# Altium project EPS.PrjPcb (part 5 of 5)
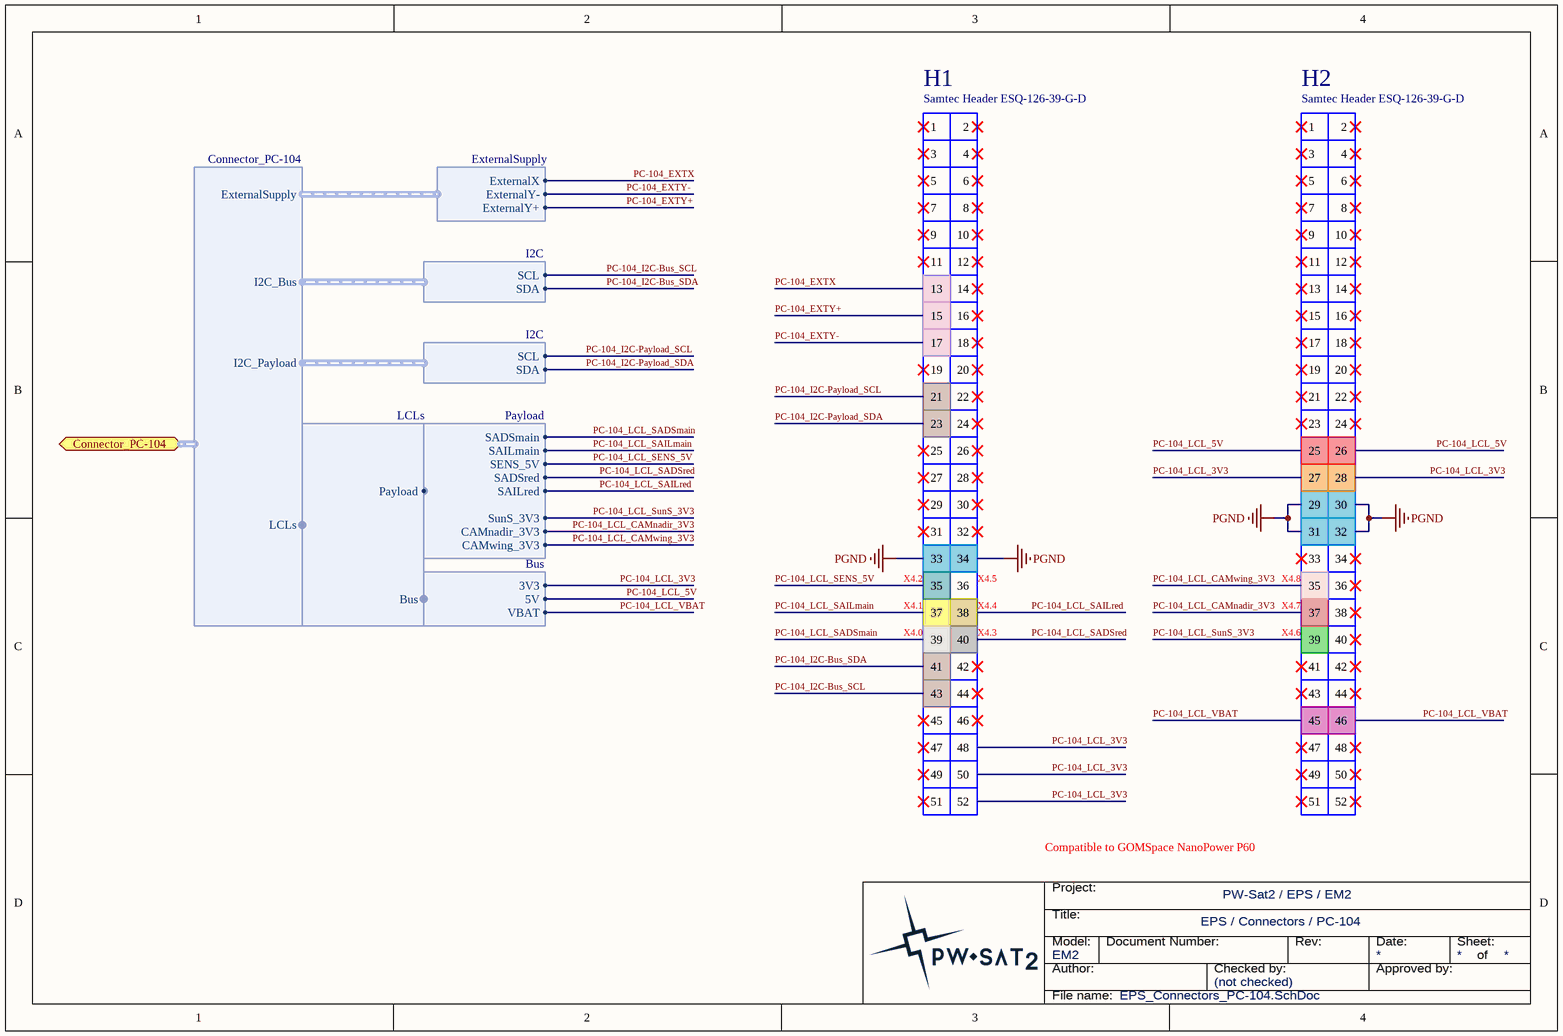
[diagram p51: EPS_Connectors_PC-104.SchDoc]

## Nets that join several sheets
AGND: Top/MPPT X/MPPTX Interface to uC (18 pins), Top/MPPT Y+/MPPTY Interface to uC (18 pins), Top/MPPT Y-/MPPTY Interface to uC (18 pins)
CTRLA_3V3a: EPS_CTRL_A (8 pins), Top/Controller A/CTRL-A_Supply (CTRL_FB1_CTRL-A_Supply.1 CTRL_FB2_CTRL-A_Supply.1), Top/MPPT X/MPPTX Measurements (MEAS_R3_MPPTX_Measurements.1), Top/MPPT Y+/MPPTY Measurements (MEAS_R3_Top_MPPT_Y+_MPPTY_Measurements.1), EPS_3V3 (TEMP_R4.2), EPS_5V (TEMP_R1.2), Top/Distribution/5V Measurements (HK_R2_5V_Measurements.1), Top/Distribution/3V3 Measurements (HK_R2_3V3_Measurements.1), Top/Distribution/VBAT Measurements (HK_R2_VBAT_Measurements.1), Top/Local-Supply and WDTs/Local-Supply CTRL-A (LS_FB1_Local-Supply_CTRL-A.2 SUPP_C1_Local-Supply_CTRL-A.1 SUPP_C2_Local-Supply_CTRL-A.1 TEMP_R5_Local-Supply_CTRL-A.2), EPS_Battery (TEMP_R2.2), Top/MPPT Y-/MPPTY Measurements (MEAS_R3_Top_MPPT_Y-_MPPTY_Measurements.1)
CTRLA_3V3d: EPS_CTRL_A (20 pins), Top/Controller A/I2C Repeater (7 pins), Top/Controller A/CTRL-A_Supply (CTRL_C1_CTRL-A_Supply.1 CTRL_C2_CTRL-A_Supply.1 CTRL_C8_CTRL-A_Supply.1 CTRL_C9_CTRL-A_Supply.1), EPS_DCDC_RLCLs (SEL_C2.1 SEL_R10.2 SEL_U1.5), Top/LCLs for DCDC/DCDC RLCL (RLCL_R3_DCDC_RLCL.2), Top/LCLs for DCDC/VBAT RLCL (RLCL_R3_VBAT_RLCL.2), EPS_Local-Supply (LS_D1.A LS_R9.2), Top/Local-Supply and WDTs/Local-Supply CTRL-A (SUPP_C5_Local-Supply_CTRL-A.1 SUPP_C6_Local-Supply_CTRL-A.1 SUPP_R2_Local-Supply_CTRL-A.1 SUPP_U3_Local-Supply_CTRL-A.6), EPS_Battery_Controller_Current-Meas (BATC_R3.1 BATC_R4.1), EPS_Battery_Heaters-Control (HTR_R1.2), EPS_CTRL_B (CTRLB_R3.2)
CTRLAB_3V3d: Top/Distribution/LCL-FPF SunS 3V3 (LCL_R2_LCL-FPF_SunS_3V3.1), Top/Distribution/LCL-FPF CAMnadir 3V3 (LCL_R2_LCL-FPF_CAMnadir_3V3.1), Top/Distribution/LCL-FPF CAMwing 3V3 (LCL_R2_LCL-FPF_CAMwing_3V3.1), Top/Distribution/LCL-TK MAIN (LCLTK_R6_LCL-TK_MAIN.1), Top/Distribution/LCL-TK Redundant (LCLTK_R6_LCL-TK_Redundant.1), Top/Distribution/LCL-FPF SENS 5V (LCL_R2_LCL-FPF_SENS_5V.1), Top/Distribution/LCL-FPF ANTs 5V (LCL_R2_Top_Distribution_LCL-FPF_ANTs_5V#1.1), Top/Distribution/LCL-FPF ANTs 5V (LCL_R2_Top_Distribution_LCL-FPF_ANTs_5V#2.1), EPS_DCDC_RLCLs (SEL_R1.2), EPS_Local-Supply (LS_R7.2 LS_R8.1 LS_R10.2), EPS_Battery_Controller_RLCL (RLCLB_R1.2)
CTRLB_3V3a: Top/Local-Supply and WDTs/Local-Supply CTRL-B (LS_FB1_Local-Supply_CTRL-B.2 SUPP_C1_Local-Supply_CTRL-B.1 SUPP_C2_Local-Supply_CTRL-B.1 TEMP_R5_Local-Supply_CTRL-B.2), EPS_CTRL_B (CTRLB_R10.2), Top/Controller B/CTRL-B_Supply (CTRL_FB1_CTRL-B_Supply.1 CTRL_FB2_CTRL-B_Supply.1)
CTRLB_3V3d: EPS_CTRL_A (CTRLA_R14.2), EPS_DCDC_RLCLs (SEL_C3.1 SEL_R11.2 SEL_U2.5), EPS_Local-Supply (LS_D2.A LS_R11.2), Top/Local-Supply and WDTs/Local-Supply CTRL-B (SUPP_C5_Local-Supply_CTRL-B.1 SUPP_C6_Local-Supply_CTRL-B.1 SUPP_R2_Local-Supply_CTRL-B.1 SUPP_U3_Local-Supply_CTRL-B.6), EPS_CTRL_B (13 pins), Top/Controller B/I2C Repeater (7 pins), Top/Controller B/CTRL-B_Supply (CTRL_C1_CTRL-B_Supply.1 CTRL_C2_CTRL-B_Supply.1 CTRL_C8_CTRL-B_Supply.1 CTRL_C9_CTRL-B_Supply.1)
CTRLB_Vref: EPS_CTRL_B (CTRLB_R9.2 CTRLB_U1.29), Top/Controller B/CTRL-B_Supply (CTRL_C5_CTRL-B_Supply.1 CTRL_C6_CTRL-B_Supply.1 CTRL_R1_CTRL-B_Supply.1 CTRL_REF1_CTRL-B_Supply.1)
DGND: EPS_CTRL_A (21 pins), Top/Controller A/I2C Repeater (5 pins), Top/Controller A/CTRL-A_Supply (12 pins), Top/Controller A/Temperature-Sensor (TEMP_C1_Top_Controller_A_Temperature-Sensor.2 TEMP_U1_Top_Controller_A_Temperature-Sensor.2), Top/Distribution/5V Measurements (HK_C4_5V_Measurements.2), Top/Distribution/3V3 Measurements (HK_C4_3V3_Measurements.2), Top/Distribution/VBAT Measurements (HK_C4_VBAT_Measurements.2), EPS_Local-Supply (LS_R9.1 LS_R10.1 LS_R11.1), EPS_CTRL_B (14 pins), Top/Controller B/I2C Repeater (5 pins), Top/Controller B/Temperature-Sensor (TEMP_C1_Top_Controller_B_Temperature-Sensor.2 TEMP_U1_Top_Controller_B_Temperature-Sensor.2), Top/Controller B/CTRL-B_Supply (12 pins)
PGND: EPS_Connectors (13 pins), Top/Controller A/CTRL-A_Supply (CTRL_J1_CTRL-A_Supply.1), EPS_MPPT_X_Boost-Converter (13 pins), EPS_MPPT_X_OR_Solar (8 pins), EPS_MPPT_X_EMI-Filter_Solar-Panels (5 pins), Top/MPPT X/MPPTX Interface to uC (MPPT_C10_MPPTX_Interface_to_uC.2 MPPT_J1_MPPTX_Interface_to_uC.1 MPPT_U4_MPPTX_Interface_to_uC.2), Top/MPPT X/MPPTX Measurements (5 pins), EPS_MPPT_X_EMI-Filter_In (EMIXI_C1.2 EMIXI_C2.2), EPS_MPPT_X_EMI-Filter_Out (EMIXO_C1.2 EMIXO_C2.2 EMIXO_C3.2), EPS_MPPT_X_OR_MPB (SUMPBX_C4.2 SUMPBX_R4.2 SUMPBX_R6.2), Top/MPPT Y+/MPPTY Buck-Boost Converter (20 pins), Top/MPPT Y+/MPPTY Solar Panels ORing (8 pins), Top/MPPT Y+/MPPTY EMI Filters for Solar Panels (EMIYS_C1_Top_MPPT_Y+_MPPTY_EMI_Filters_for_Solar_Panels.2 EMIYS_C2_Top_MPPT_Y+_MPPTY_EMI_Filters_for_Solar_Panels.2 EMIYS_T1_Top_MPPT_Y+_MPPTY_EMI_Filters_for_Solar_Panels.3), Top/MPPT Y+/MPPTY Interface to uC (MPPT_C10_Top_MPPT_Y+_MPPTY_Interface_to_uC.2 MPPT_J1_Top_MPPT_Y+_MPPTY_Interface_to_uC.1 MPPT_U4_Top_MPPT_Y+_MPPTY_Interface_to_uC.2), Top/MPPT Y+/MPPTY Measurements (5 pins), Top/MPPT Y+/MPPTY Input EMI Filter (EMIYI_C1_Top_MPPT_Y+_MPPTY_Input_EMI_Filter.2 EMIYI_C2_Top_MPPT_Y+_MPPTY_Input_EMI_Filter.2), Top/MPPT Y+/MPPTY Output EMI Filter (EMIYO_C1_Top_MPPT_Y+_MPPTY_Output_EMI_Filter.2 EMIYO_C2_Top_MPPT_Y+_MPPTY_Output_EMI_Filter.2 EMIYO_C3_Top_MPPT_Y+_MPPTY_Output_EMI_Filter.2), Top/MPPT Y+/MPPTY ORing to MPB (5 pins), EPS_3V3_Buck-Converter (17 pins), EPS_3V3_EMI-Filter_In (EMIAA_C2.2 EMIAA_C3.2), EPS_3V3_EMI-Filter_Out (EMIAB_C2.2 EMIAB_C3.2 EMIAB_C4.2), Top/3V3/Temperature-Sensor (TEMP_C1_Top_3V3_Temperature-Sensor.2 TEMP_U1_Top_3V3_Temperature-Sensor.2), EPS_5V_Buck-Converter (17 pins), EPS_5V_EMI-Filter_In (EMIBA_C2.2 EMIBA_C3.2), EPS_5V_EMI-Filter_Out (EMIBB_C2.2 EMIBB_C3.2 EMIBB_C4.2), Top/5V/Temperature-Sensor (TEMP_C1_Top_5V_Temperature-Sensor.2 TEMP_U1_Top_5V_Temperature-Sensor.2), EPS_RBL (RBL_C2.2 RBL_C4.2 RBL_Q2.E RBL_Q4.E), EPS_Distribution (8 pins), Top/Distribution/LCL-FPF SunS 3V3 (LCL_C2_LCL-FPF_SunS_3V3.2 LCL_C3_LCL-FPF_SunS_3V3.2 LCL_R3_LCL-FPF_SunS_3V3.1 LCL_R5_LCL-FPF_SunS_3V3.1), Top/Distribution/LCL-FPF CAMnadir 3V3 (LCL_C2_LCL-FPF_CAMnadir_3V3.2 LCL_C3_LCL-FPF_CAMnadir_3V3.2 LCL_R3_LCL-FPF_CAMnadir_3V3.1 LCL_R5_LCL-FPF_CAMnadir_3V3.1), Top/Distribution/LCL-FPF CAMwing 3V3 (LCL_C2_LCL-FPF_CAMwing_3V3.2 LCL_C3_LCL-FPF_CAMwing_3V3.2 LCL_R3_LCL-FPF_CAMwing_3V3.1 LCL_R5_LCL-FPF_CAMwing_3V3.1), Top/Distribution/LCL-TK MAIN (10 pins), Top/Distribution/LCL-TK Redundant (10 pins), Top/Distribution/LCL-FPF SENS 5V (LCL_C2_LCL-FPF_SENS_5V.2 LCL_C3_LCL-FPF_SENS_5V.2 LCL_R3_LCL-FPF_SENS_5V.1 LCL_R5_LCL-FPF_SENS_5V.1), Top/Distribution/RLCL-FPF 5V (6 pins), Top/Distribution/5V Measurements (5 pins), Top/Distribution/3V3 Measurements (5 pins), Top/Distribution/VBAT Measurements (5 pins), Top/Distribution/LCL-FPF ANTs 5V (LCL_C2_Top_Distribution_LCL-FPF_ANTs_5V#1.2 LCL_C3_Top_Distribution_LCL-FPF_ANTs_5V#1.2 LCL_R3_Top_Distribution_LCL-FPF_ANTs_5V#1.1 LCL_R5_Top_Distribution_LCL-FPF_ANTs_5V#1.1), Top/Distribution/RLCL-FPF 3V3 (6 pins), Top/Distribution/LCL-FPF ANTs 5V (LCL_C2_Top_Distribution_LCL-FPF_ANTs_5V#2.2 LCL_C3_Top_Distribution_LCL-FPF_ANTs_5V#2.2 LCL_R3_Top_Distribution_LCL-FPF_ANTs_5V#2.1 LCL_R5_Top_Distribution_LCL-FPF_ANTs_5V#2.1), EPS_VBAT_EMI-Filter (EMIVBAT_C3.2 EMIVBAT_C4.2 EMIVBAT_C5.2), EPS_DCDC_RLCLs (13 pins), Top/LCLs for DCDC/DCDC RLCL (RLCL_C4_DCDC_RLCL.2 RLCL_C5_DCDC_RLCL.2 RLCL_R4_DCDC_RLCL.1 RLCL_R5_DCDC_RLCL.2), Top/LCLs for DCDC/VBAT RLCL (RLCL_C4_VBAT_RLCL.2 RLCL_C5_VBAT_RLCL.2 RLCL_R4_VBAT_RLCL.1 RLCL_R5_VBAT_RLCL.2), EPS_Local-Supply (LS_C2.2 LS_R4.2), Top/Local-Supply and WDTs/Local-Supply CTRL-A (17 pins), Top/Local-Supply and WDTs/Local-Supply CTRL-A/Temperature-Sensor (TEMP_C1_Top_Local-Supply_and_WDTs_Local-Supply_CTRL-A_Temperature-Sensor.2 TEMP_U1_Top_Local-Supply_and_WDTs_Local-Supply_CTRL-A_Temperature-Sensor.2), Top/Local-Supply and WDTs/Local-Supply CTRL-B (17 pins), Top/Local-Supply and WDTs/Local-Supply CTRL-B/Temperature-Sensor (TEMP_C1_Top_Local-Supply_and_WDTs_Local-Supply_CTRL-B_Temperature-Sensor.2 TEMP_U1_Top_Local-Supply_and_WDTs_Local-Supply_CTRL-B_Temperature-Sensor.2), EPS_Battery_Controller_Current-Meas (BATC_R2.2 BATC_R5.1), EPS_Battery_Controller_Voltage-Meas (BATV_C1.2 BATV_C2.2 BATV_R2.2 BATV_R4.2), EPS_Battery_Controller_Diode (BATD_R2.2), EPS_Battery_Controller_RLCL (9 pins), EPS_Battery_Heaters-Control (HTR_Q2.E HTR_Q3.S HTR_R3.1 HTR_R7.1), Top/Battery Pack/Temperature-Sensor (TEMP_C1_Top_Battery_Pack_Temperature-Sensor.2 TEMP_U1_Top_Battery_Pack_Temperature-Sensor.2), Top/MPPT Y-/MPPTY Buck-Boost Converter (20 pins), Top/MPPT Y-/MPPTY Solar Panels ORing (8 pins), Top/MPPT Y-/MPPTY EMI Filters for Solar Panels (EMIYS_C1_Top_MPPT_Y-_MPPTY_EMI_Filters_for_Solar_Panels.2 EMIYS_C2_Top_MPPT_Y-_MPPTY_EMI_Filters_for_Solar_Panels.2 EMIYS_T1_Top_MPPT_Y-_MPPTY_EMI_Filters_for_Solar_Panels.3), Top/MPPT Y-/MPPTY Interface to uC (MPPT_C10_Top_MPPT_Y-_MPPTY_Interface_to_uC.2 MPPT_J1_Top_MPPT_Y-_MPPTY_Interface_to_uC.1 MPPT_U4_Top_MPPT_Y-_MPPTY_Interface_to_uC.2), Top/MPPT Y-/MPPTY Measurements (5 pins), Top/MPPT Y-/MPPTY Input EMI Filter (EMIYI_C1_Top_MPPT_Y-_MPPTY_Input_EMI_Filter.2 EMIYI_C2_Top_MPPT_Y-_MPPTY_Input_EMI_Filter.2), Top/MPPT Y-/MPPTY Output EMI Filter (EMIYO_C1_Top_MPPT_Y-_MPPTY_Output_EMI_Filter.2 EMIYO_C2_Top_MPPT_Y-_MPPTY_Output_EMI_Filter.2 EMIYO_C3_Top_MPPT_Y-_MPPTY_Output_EMI_Filter.2), Top/MPPT Y-/MPPTY ORing to MPB (5 pins), EPS_CTRL_B (CTRLB_C5.2 CTRLB_J1.1), Top/Controller B/CTRL-B_Supply (CTRL_J1_CTRL-B_Supply.1), EPS_Connectors_PC-104 (6 pins)
BAT_MEAS_VOLTAGE_N: EPS_CTRL_A (CTRLA_U3.10), EPS_Battery_Controller_Voltage-Meas (BATV_C1.1 BATV_R1.2 BATV_R2.1)
BAT_MEAS_VOLTAGE_R: EPS_Battery_Controller_Voltage-Meas (BATV_C2.1 BATV_R3.2 BATV_R4.1), EPS_CTRL_B (CTRLB_U1.36)
CHRG_LCL_FB: EPS_CTRL_A (CTRLA_R20.2 CTRLA_U4.43), EPS_Battery_Controller_RLCL (RLCLB_U1.7)
CHRG_LCLN_ON: EPS_CTRL_A (CTRLA_U4.33), EPS_Battery_Controller_RLCL (RLCLB_R10.1)
CHRG_LCLR_ON: EPS_Battery_Controller_RLCL (RLCLB_R9.1), EPS_CTRL_B (CTRLB_U1.11)
CHRG_MEAS_CURRENT: EPS_CTRL_A (CTRLA_U3.12), EPS_Battery_Controller_Current-Meas (BATC_U1.2)
CTRLA_BATC_CURR_DCHRG: EPS_CTRL_A (CTRLA_U3.11), EPS_Battery_Controller_Current-Meas (BATC_U2.2)
CTRLA_BATC_Heater: EPS_CTRL_A (CTRLA_U4.34), EPS_Battery_Heaters-Control (HTR_R8.2)
CTRLA_BATC_TEMP: EPS_CTRL_A (CTRLA_U3.13), Top/Battery Pack/Temperature-Sensor (TEMP_R1_Top_Battery_Pack_Temperature-Sensor.2)
CTRLA_BURN_SADS: EPS_CTRL_A (CTRLA_U4.42), Top/Distribution/LCL-TK MAIN (LCLTK_R11_LCL-TK_MAIN.2 LCLTK_R12_LCL-TK_MAIN.2)
CTRLA_BURN_SAIL: EPS_CTRL_A (CTRLA_U4.41), Top/Distribution/LCL-TK MAIN (LCLTK_R3_LCL-TK_MAIN.2 LCLTK_R5_LCL-TK_MAIN.2)
CTRLA_HK_3V3_CURR: EPS_CTRL_A (CTRLA_U2.6), Top/Distribution/3V3 Measurements (HK_C4_3V3_Measurements.1 HK_R5_3V3_Measurements.2)
CTRLA_HK_3V3_TEMP: EPS_CTRL_A (CTRLA_U2.11), Top/3V3/Temperature-Sensor (TEMP_R1_Top_3V3_Temperature-Sensor.2)
CTRLA_HK_3V3_VOLT: EPS_CTRL_A (CTRLA_U2.7), Top/Distribution/3V3 Measurements (HK_C1_3V3_Measurements.1 HK_R3_3V3_Measurements.2 HK_R4_3V3_Measurements.1)
CTRLA_HK_5V_CURR: EPS_CTRL_A (CTRLA_U2.13), Top/Distribution/5V Measurements (HK_C4_5V_Measurements.1 HK_R5_5V_Measurements.2)
CTRLA_HK_5V_TEMP: EPS_CTRL_A (CTRLA_U2.10), Top/5V/Temperature-Sensor (TEMP_R1_Top_5V_Temperature-Sensor.2)
CTRLA_HK_5V_VOLT: EPS_CTRL_A (CTRLA_U2.12), Top/Distribution/5V Measurements (HK_C1_5V_Measurements.1 HK_R3_5V_Measurements.2 HK_R4_5V_Measurements.1)
CTRLA_HK_SUPP_TEMP: EPS_CTRL_A (CTRLA_U3.7), Top/Local-Supply and WDTs/Local-Supply CTRL-A/Temperature-Sensor (TEMP_R1_Top_Local-Supply_and_WDTs_Local-Supply_CTRL-A_Temperature-Sensor.2)
CTRLA_HK_TEMP: EPS_CTRL_A (CTRLA_U3.5), Top/Controller A/Temperature-Sensor (TEMP_R1_Top_Controller_A_Temperature-Sensor.2)
CTRLA_HK_VBAT_CURR: EPS_CTRL_A (CTRLA_U2.4), Top/Distribution/VBAT Measurements (HK_C4_VBAT_Measurements.1 HK_R5_VBAT_Measurements.2)
CTRLA_HK_VBAT_VOLT: EPS_CTRL_A (CTRLA_U2.5), Top/Distribution/VBAT Measurements (HK_C1_VBAT_Measurements.1 HK_R3_VBAT_Measurements.2 HK_R4_VBAT_Measurements.1)
CTRLA_LCLs_ANTs_FlagB: EPS_CTRL_A (CTRLA_R12.2 CTRLA_U4.46), Top/Distribution/LCL-FPF ANTs 5V (LCL_U1_Top_Distribution_LCL-FPF_ANTs_5V#1.7)
CTRLA_LCLs_ANTs_ON: EPS_CTRL_A (CTRLA_U4.40), Top/Distribution/LCL-FPF ANTs 5V (LCL_R4_Top_Distribution_LCL-FPF_ANTs_5V#1.2)
CTRLA_LCLs_CAMnadir_FlagB: EPS_CTRL_A (CTRLA_R8.2 CTRLA_U4.49), Top/Distribution/LCL-FPF CAMnadir 3V3 (LCL_U1_LCL-FPF_CAMnadir_3V3.7)
CTRLA_LCLs_CAMnadir_ON: EPS_CTRL_A (CTRLA_U4.37), Top/Distribution/LCL-FPF CAMnadir 3V3 (LCL_R4_LCL-FPF_CAMnadir_3V3.2)
CTRLA_LCLs_CAMwing_FlagB: EPS_CTRL_A (CTRLA_R9.2 CTRLA_U4.48), Top/Distribution/LCL-FPF CAMwing 3V3 (LCL_U1_LCL-FPF_CAMwing_3V3.7)
CTRLA_LCLs_CAMwing_ON: EPS_CTRL_A (CTRLA_U4.38), Top/Distribution/LCL-FPF CAMwing 3V3 (LCL_R4_LCL-FPF_CAMwing_3V3.2)
CTRLA_LCLs_SENS_FlagB: EPS_CTRL_A (CTRLA_R10.2 CTRLA_U4.47), Top/Distribution/LCL-FPF SENS 5V (LCL_U1_LCL-FPF_SENS_5V.7)
CTRLA_LCLs_SENS_ON: EPS_CTRL_A (CTRLA_U4.39), Top/Distribution/LCL-FPF SENS 5V (LCL_R4_LCL-FPF_SENS_5V.2)
CTRLA_LCLs_Suns_FlagB: EPS_CTRL_A (CTRLA_R5.2 CTRLA_U4.50), Top/Distribution/LCL-FPF SunS 3V3 (LCL_U1_LCL-FPF_SunS_3V3.7)
CTRLA_LCLs_SunS_ON: EPS_CTRL_A (CTRLA_U4.36), Top/Distribution/LCL-FPF SunS 3V3 (LCL_R4_LCL-FPF_SunS_3V3.2)
CTRLA_LCLs_TKmain_FlagB: EPS_CTRL_A (CTRLA_R2.2 CTRLA_U4.51), Top/Distribution/LCL-TK MAIN (LCLTK_U1_LCL-TK_MAIN.7)
CTRLA_LCLs_TKmain_ON: EPS_CTRL_A (CTRLA_U4.35), Top/Distribution/LCL-TK MAIN (LCLTK_R13_LCL-TK_MAIN.2)
CTRLB_BATC_Heater: EPS_Battery_Heaters-Control (HTR_R6.1), EPS_CTRL_B (CTRLB_U1.12)
CTRLB_BURN_SADS: Top/Distribution/LCL-TK Redundant (LCLTK_R11_LCL-TK_Redundant.2 LCLTK_R12_LCL-TK_Redundant.2), EPS_CTRL_B (CTRLB_U1.16)
CTRLB_BURN_SAIL: Top/Distribution/LCL-TK Redundant (LCLTK_R3_LCL-TK_Redundant.2 LCLTK_R5_LCL-TK_Redundant.2), EPS_CTRL_B (CTRLB_U1.15)
CTRLB_HK_SUPP_TEMP: Top/Local-Supply and WDTs/Local-Supply CTRL-B/Temperature-Sensor (TEMP_R1_Top_Local-Supply_and_WDTs_Local-Supply_CTRL-B_Temperature-Sensor.2), EPS_CTRL_B (CTRLB_U1.34)
CTRLB_HK_TEMP: EPS_CTRL_B (CTRLB_U1.37), Top/Controller B/Temperature-Sensor (TEMP_R1_Top_Controller_B_Temperature-Sensor.2)
CTRLB_LCLs_ANTs_FlagB: Top/Distribution/LCL-FPF ANTs 5V (LCL_U1_Top_Distribution_LCL-FPF_ANTs_5V#2.7), EPS_CTRL_B (CTRLB_R2.2 CTRLB_U1.30)
CTRLB_LCLs_ANTs_ON: Top/Distribution/LCL-FPF ANTs 5V (LCL_R4_Top_Distribution_LCL-FPF_ANTs_5V#2.2), EPS_CTRL_B (CTRLB_U1.26)
CTRLB_LCLs_TKred_FlagB: Top/Distribution/LCL-TK Redundant (LCLTK_U1_LCL-TK_Redundant.7), EPS_CTRL_B (CTRLB_R1.2 CTRLB_U1.31)
CTRLB_LCLs_TKred_ON: Top/Distribution/LCL-TK Redundant (LCLTK_R13_LCL-TK_Redundant.2), EPS_CTRL_B (CTRLB_U1.25)
MPPT_3V3a: EPS_CTRL_A (CTRLA_J1.1), Top/MPPT X/MPPTX Interface to uC (12 pins)
MPPT_3V3a: EPS_CTRL_A (CTRLA_J2.1), Top/MPPT Y+/MPPTY Interface to uC (12 pins)
MPPT_3V3a: EPS_CTRL_A (CTRLA_J4.1), Top/MPPT Y-/MPPTY Interface to uC (12 pins)
MPPT_CS_ADC: EPS_CTRL_A (CTRLA_R1.1), Top/MPPT X/MPPTX Interface to uC (MPPT_U3_MPPTX_Interface_to_uC.1)
MPPT_CS_ADC: EPS_CTRL_A (CTRLA_R11.2), Top/MPPT Y+/MPPTY Interface to uC (MPPT_U3_Top_MPPT_Y+_MPPTY_Interface_to_uC.1)
MPPT_CS_ADC: EPS_CTRL_A (CTRLA_R24.2), Top/MPPT Y-/MPPTY Interface to uC (MPPT_U3_Top_MPPT_Y-_MPPTY_Interface_to_uC.1)
MPPT_CS_DAC: EPS_CTRL_A (CTRLA_R1.2), Top/MPPT X/MPPTX Interface to uC (MPPT_U2_MPPTX_Interface_to_uC.6)
MPPT_CS_DAC: EPS_CTRL_A (CTRLA_R11.4), Top/MPPT Y+/MPPTY Interface to uC (MPPT_U2_Top_MPPT_Y+_MPPTY_Interface_to_uC.6)
MPPT_CS_DAC: EPS_CTRL_A (CTRLA_R24.1), Top/MPPT Y-/MPPTY Interface to uC (MPPT_U2_Top_MPPT_Y-_MPPTY_Interface_to_uC.6)
MPPT_DIN: EPS_CTRL_A (CTRLA_R1.3), Top/MPPT X/MPPTX Interface to uC (MPPT_U2_MPPTX_Interface_to_uC.4 MPPT_U3_MPPTX_Interface_to_uC.8)
MPPT_DIN: EPS_CTRL_A (CTRLA_R11.3), Top/MPPT Y+/MPPTY Interface to uC (MPPT_U2_Top_MPPT_Y+_MPPTY_Interface_to_uC.4 MPPT_U3_Top_MPPT_Y+_MPPTY_Interface_to_uC.8)
MPPT_DIN: EPS_CTRL_A (CTRLA_R24.4), Top/MPPT Y-/MPPTY Interface to uC (MPPT_U2_Top_MPPT_Y-_MPPTY_Interface_to_uC.4 MPPT_U3_Top_MPPT_Y-_MPPTY_Interface_to_uC.8)
MPPT_DOUT: EPS_CTRL_A (CTRLA_R1.4), Top/MPPT X/MPPTX Interface to uC (MPPT_U3_MPPTX_Interface_to_uC.9)
MPPT_DOUT: EPS_CTRL_A (CTRLA_R11.1), Top/MPPT Y+/MPPTY Interface to uC (MPPT_U3_Top_MPPT_Y+_MPPTY_Interface_to_uC.9)
MPPT_DOUT: EPS_CTRL_A (CTRLA_R24.3), Top/MPPT Y-/MPPTY Interface to uC (MPPT_U3_Top_MPPT_Y-_MPPTY_Interface_to_uC.9)
MPPT_Meas_I: Top/MPPT X/MPPTX Interface to uC (MPPT_R10_MPPTX_Interface_to_uC.2), Top/MPPT X/MPPTX Measurements (MEAS_U1_MPPTX_Measurements.2)
MPPT_Meas_I: Top/MPPT Y+/MPPTY Interface to uC (MPPT_R10_Top_MPPT_Y+_MPPTY_Interface_to_uC.2), Top/MPPT Y+/MPPTY Measurements (MEAS_U1_Top_MPPT_Y+_MPPTY_Measurements.2)
MPPT_Meas_I: Top/MPPT Y-/MPPTY Interface to uC (MPPT_R10_Top_MPPT_Y-_MPPTY_Interface_to_uC.2), Top/MPPT Y-/MPPTY Measurements (MEAS_U1_Top_MPPT_Y-_MPPTY_Measurements.2)
MPPT_Meas_V: Top/MPPT X/MPPTX Interface to uC (MPPT_R1_MPPTX_Interface_to_uC.2 MPPT_U3_MPPTX_Interface_to_uC.6), Top/MPPT X/MPPTX Measurements (MEAS_C1_MPPTX_Measurements.1 MEAS_R2_MPPTX_Measurements.2 MEAS_R4_MPPTX_Measurements.1)
MPPT_Meas_V: Top/MPPT Y+/MPPTY Interface to uC (MPPT_R1_Top_MPPT_Y+_MPPTY_Interface_to_uC.2 MPPT_U3_Top_MPPT_Y+_MPPTY_Interface_to_uC.6), Top/MPPT Y+/MPPTY Measurements (MEAS_C1_Top_MPPT_Y+_MPPTY_Measurements.1 MEAS_R2_Top_MPPT_Y+_MPPTY_Measurements.2 MEAS_R4_Top_MPPT_Y+_MPPTY_Measurements.1)
MPPT_Meas_V: Top/MPPT Y-/MPPTY Interface to uC (MPPT_R1_Top_MPPT_Y-_MPPTY_Interface_to_uC.2 MPPT_U3_Top_MPPT_Y-_MPPTY_Interface_to_uC.6), Top/MPPT Y-/MPPTY Measurements (MEAS_C1_Top_MPPT_Y-_MPPTY_Measurements.1 MEAS_R2_Top_MPPT_Y-_MPPTY_Measurements.2 MEAS_R4_Top_MPPT_Y-_MPPTY_Measurements.1)
MPPT_SCLK: EPS_CTRL_A (CTRLA_R4.2), Top/MPPT X/MPPTX Interface to uC (MPPT_U2_MPPTX_Interface_to_uC.5 MPPT_U3_MPPTX_Interface_to_uC.10)
MPPT_SCLK: EPS_CTRL_A (CTRLA_R13.2), Top/MPPT Y+/MPPTY Interface to uC (MPPT_U2_Top_MPPT_Y+_MPPTY_Interface_to_uC.5 MPPT_U3_Top_MPPT_Y+_MPPTY_Interface_to_uC.10)
MPPT_SCLK: EPS_CTRL_A (CTRLA_R25.2), Top/MPPT Y-/MPPTY Interface to uC (MPPT_U2_Top_MPPT_Y-_MPPTY_Interface_to_uC.5 MPPT_U3_Top_MPPT_Y-_MPPTY_Interface_to_uC.10)
NetBATC_R1_1: EPS_Battery_Controller_Current-Meas (BATC_R1.1), EPS_Battery_Controller_Diode (BATD_D1.K BATD_Q1.S BATD_R1.1 BATD_U1.6), EPS_Battery_Controller_RLCL (5 pins)
NetBATC_R1_4: EPS_Connectors (H3.2 H4.2), EPS_MPPT_X_OR_MPB (7 pins), Top/MPPT Y+/MPPTY ORing to MPB (6 pins), EPS_Battery_Controller_Current-Meas (BATC_R1.4), Top/MPPT Y-/MPPTY ORing to MPB (6 pins)
NetBATD_C3_1: EPS_Connectors (H9.1 H9.2 H9.9 H9.10), EPS_Battery_Controller_Voltage-Meas (BATV_R1.1 BATV_R3.1), EPS_Battery_Controller_Diode (5 pins), EPS_Battery_Controller_RLCL (RLCLB_C5.1 RLCLB_R4.2 RLCLB_U1.8)
NetCTRL_C3_CTRL-A_Supply_1: EPS_CTRL_A (CTRLA_U4.64), Top/Controller A/CTRL-A_Supply (CTRL_C3_CTRL-A_Supply.1 CTRL_C4_CTRL-A_Supply.1 CTRL_FB1_CTRL-A_Supply.2)
NetCTRL_C3_CTRL-B_Supply_1: EPS_CTRL_B (CTRLB_U1.27), Top/Controller B/CTRL-B_Supply (CTRL_C3_CTRL-B_Supply.1 CTRL_C4_CTRL-B_Supply.1 CTRL_FB1_CTRL-B_Supply.2)
NetCTRL_C5_CTRL-A_Supply_1: EPS_CTRL_A (CTRLA_U4.62), Top/Controller A/CTRL-A_Supply (CTRL_C5_CTRL-A_Supply.1 CTRL_C6_CTRL-A_Supply.1 CTRL_R1_CTRL-A_Supply.1 CTRL_REF1_CTRL-A_Supply.1)
NetCTRLA_J3_1: EPS_Connectors (H9.6), EPS_CTRL_A (CTRLA_J3.1)
NetCTRLA_R16_1: EPS_Connectors (H9.7), EPS_CTRL_A (CTRLA_R16.1)
NetCTRLA_R16_2: EPS_Connectors (H9.15), EPS_CTRL_A (CTRLA_R16.2)
NetCTRLA_R16_3: EPS_Connectors (H9.5), EPS_CTRL_A (CTRLA_R16.3)
NetCTRLA_R16_4: EPS_Connectors (H9.13), EPS_CTRL_A (CTRLA_R16.4)
NetCTRLA_R17_2: EPS_Connectors (H9.14), EPS_CTRL_A (CTRLA_R17.2)
NetCTRLA_R21_1: EPS_CTRL_A (CTRLA_R21.1), Top/Controller A/Temperature-Sensor (TEMP_C1_Top_Controller_A_Temperature-Sensor.1 TEMP_U1_Top_Controller_A_Temperature-Sensor.1 TEMP_U1_Top_Controller_A_Temperature-Sensor.4 TEMP_U1_Top_Controller_A_Temperature-Sensor.5)
NetCTRLA_U4_6: EPS_CTRL_A (CTRLA_U4.6), Top/Controller A/I2C Repeater (RPT_R3_Top_Controller_A_I2C_Repeater.2)
NetCTRLA_U4_7: EPS_CTRL_A (CTRLA_U4.7), Top/Controller A/I2C Repeater (RPT_R5_Top_Controller_A_I2C_Repeater.2)
NetCTRLA_U4_14: EPS_CTRL_A (CTRLA_U4.14), EPS_DCDC_RLCLs (SEL_R4.1)
NetCTRLA_U4_15: EPS_CTRL_A (CTRLA_U4.15), EPS_DCDC_RLCLs (SEL_R6.2)
NetCTRLA_U4_17: EPS_CTRL_A (CTRLA_U4.17), Top/Local-Supply and WDTs/Local-Supply CTRL-A (SUPP_R13_Local-Supply_CTRL-A.2)
NetCTRLB_C5_1: EPS_Connectors (H9.8), EPS_CTRL_B (CTRLB_C5.1 CTRLB_R9.1 CTRLB_R11.1)
NetCTRLB_R10_1: EPS_CTRL_B (CTRLB_R10.1), Top/Controller B/Temperature-Sensor (TEMP_C1_Top_Controller_B_Temperature-Sensor.1 TEMP_U1_Top_Controller_B_Temperature-Sensor.1 TEMP_U1_Top_Controller_B_Temperature-Sensor.4 TEMP_U1_Top_Controller_B_Temperature-Sensor.5)
NetCTRLB_U1_1: Top/MPPT X/MPPTX Interface to uC (MPPT_R16_MPPTX_Interface_to_uC.2 MPPT_U5_MPPTX_Interface_to_uC.5), EPS_CTRL_B (CTRLB_U1.1)
NetCTRLB_U1_2: Top/MPPT Y+/MPPTY Interface to uC (MPPT_R16_Top_MPPT_Y+_MPPTY_Interface_to_uC.2 MPPT_U5_Top_MPPT_Y+_MPPTY_Interface_to_uC.5), EPS_CTRL_B (CTRLB_U1.2)
NetCTRLB_U1_3: Top/MPPT Y-/MPPTY Interface to uC (MPPT_R16_Top_MPPT_Y-_MPPTY_Interface_to_uC.2 MPPT_U5_Top_MPPT_Y-_MPPTY_Interface_to_uC.5), EPS_CTRL_B (CTRLB_U1.3)
NetCTRLB_U1_13: EPS_DCDC_RLCLs (SEL_R5.1), EPS_CTRL_B (CTRLB_U1.13)
NetCTRLB_U1_14: EPS_DCDC_RLCLs (SEL_R7.2), EPS_CTRL_B (CTRLB_U1.14)
NetCTRLB_U1_19: EPS_CTRL_B (CTRLB_U1.19), Top/Controller B/I2C Repeater (RPT_R3_Top_Controller_B_I2C_Repeater.2)
NetCTRLB_U1_20: EPS_CTRL_B (CTRLB_U1.20), Top/Controller B/I2C Repeater (RPT_R5_Top_Controller_B_I2C_Repeater.2)
NetCTRLB_U1_42: Top/Local-Supply and WDTs/Local-Supply CTRL-B (SUPP_R13_Local-Supply_CTRL-B.2), EPS_CTRL_B (CTRLB_U1.42)
NetDCDCA_C3_1: EPS_3V3_Buck-Converter (DCDCA_C3.1 DCDCA_C7.1 DCDCA_C8.1 DCDCA_U1.7), EPS_3V3_EMI-Filter_In (EMIAA_L1.1 EMIAA_L2.1 EMIAA_R2.2)
NetDCDCA_C4_1: EPS_3V3_Buck-Converter (8 pins), EPS_3V3_EMI-Filter_Out (EMIAB_FB1.2 EMIAB_FB2.2)
NetDCDCB_C3_1: EPS_5V_Buck-Converter (DCDCB_C3.1 DCDCB_C7.1 DCDCB_C8.1 DCDCB_U1.7), EPS_5V_EMI-Filter_In (EMIBA_L1.1 EMIBA_L2.1 EMIBA_R2.2)
NetDCDCB_C4_1: EPS_5V_Buck-Converter (8 pins), EPS_5V_EMI-Filter_Out (EMIBB_FB1.2 EMIBB_FB2.2)
NetDCDCX_C1_2: EPS_MPPT_X_Boost-Converter (6 pins), EPS_MPPT_X_EMI-Filter_In (EMIXI_L1.1 EMIXI_L2.1 EMIXI_R2.2)
NetDCDCX_C2_2: EPS_MPPT_X_Boost-Converter (5 pins), EPS_MPPT_X_EMI-Filter_Out (EMIXO_FB1.2)
NetDCDCX_R7_2: EPS_MPPT_X_Boost-Converter (DCDCX_R7.2), Top/MPPT X/MPPTX Interface to uC (MPPT_C4_MPPTX_Interface_to_uC.2 MPPT_R4_MPPTX_Interface_to_uC.1 MPPT_U1_MPPTX_Interface_to_uC.1)
NetDCDCY_C3_Top_MPPT_Y+_MPPTY_Buck-Boost_Converter_2: Top/MPPT Y+/MPPTY Buck-Boost Converter (6 pins), Top/MPPT Y+/MPPTY Input EMI Filter (EMIYI_L1_Top_MPPT_Y+_MPPTY_Input_EMI_Filter.1 EMIYI_L2_Top_MPPT_Y+_MPPTY_Input_EMI_Filter.1 EMIYI_R2_Top_MPPT_Y+_MPPTY_Input_EMI_Filter.2)
NetDCDCY_C3_Top_MPPT_Y-_MPPTY_Buck-Boost_Converter_2: Top/MPPT Y-/MPPTY Buck-Boost Converter (6 pins), Top/MPPT Y-/MPPTY Input EMI Filter (EMIYI_L1_Top_MPPT_Y-_MPPTY_Input_EMI_Filter.1 EMIYI_L2_Top_MPPT_Y-_MPPTY_Input_EMI_Filter.1 EMIYI_R2_Top_MPPT_Y-_MPPTY_Input_EMI_Filter.2)
NetDCDCY_C4_Top_MPPT_Y+_MPPTY_Buck-Boost_Converter_2: Top/MPPT Y+/MPPTY Buck-Boost Converter (6 pins), Top/MPPT Y+/MPPTY Output EMI Filter (EMIYO_FB1_Top_MPPT_Y+_MPPTY_Output_EMI_Filter.2)
NetDCDCY_C4_Top_MPPT_Y-_MPPTY_Buck-Boost_Converter_2: Top/MPPT Y-/MPPTY Buck-Boost Converter (6 pins), Top/MPPT Y-/MPPTY Output EMI Filter (EMIYO_FB1_Top_MPPT_Y-_MPPTY_Output_EMI_Filter.2)
NetDCDCY_R7_Top_MPPT_Y+_MPPTY_Buck-Boost_Converter_1: Top/MPPT Y+/MPPTY Buck-Boost Converter (DCDCY_R7_Top_MPPT_Y+_MPPTY_Buck-Boost_Converter.1), Top/MPPT Y+/MPPTY Interface to uC (MPPT_C4_Top_MPPT_Y+_MPPTY_Interface_to_uC.2 MPPT_R4_Top_MPPT_Y+_MPPTY_Interface_to_uC.1 MPPT_U1_Top_MPPT_Y+_MPPTY_Interface_to_uC.1)
NetDCDCY_R7_Top_MPPT_Y-_MPPTY_Buck-Boost_Converter_1: Top/MPPT Y-/MPPTY Buck-Boost Converter (DCDCY_R7_Top_MPPT_Y-_MPPTY_Buck-Boost_Converter.1), Top/MPPT Y-/MPPTY Interface to uC (MPPT_C4_Top_MPPT_Y-_MPPTY_Interface_to_uC.2 MPPT_R4_Top_MPPT_Y-_MPPTY_Interface_to_uC.1 MPPT_U1_Top_MPPT_Y-_MPPTY_Interface_to_uC.1)
NetDISTR_R1_2: EPS_Distribution (DISTR_R1.2), Top/Distribution/LCL-FPF SunS 3V3 (LCL_U1_LCL-FPF_SunS_3V3.3)
NetDISTR_R2_2: EPS_Distribution (DISTR_R2.2), Top/Distribution/LCL-FPF CAMnadir 3V3 (LCL_U1_LCL-FPF_CAMnadir_3V3.3)
NetDISTR_R3_2: EPS_Distribution (DISTR_R3.2), Top/Distribution/LCL-FPF CAMwing 3V3 (LCL_U1_LCL-FPF_CAMwing_3V3.3)
NetDISTR_R4_2: EPS_Distribution (DISTR_R4.2), Top/Distribution/LCL-FPF SENS 5V (LCL_U1_LCL-FPF_SENS_5V.3)
NetDISTR_R5_2: EPS_Distribution (DISTR_R5.2), Top/Distribution/LCL-FPF ANTs 5V (LCL_U1_Top_Distribution_LCL-FPF_ANTs_5V#1.3)
NetDISTR_R6_2: EPS_Distribution (DISTR_R6.2), Top/Distribution/LCL-FPF ANTs 5V (LCL_U1_Top_Distribution_LCL-FPF_ANTs_5V#2.3)
NetDISTR_R7_2: EPS_Distribution (DISTR_R7.2), Top/Distribution/RLCL-FPF 3V3 (RLCL_U1_RLCL-FPF_3V3.3)
NetDISTR_R8_2: EPS_Distribution (DISTR_R8.2), Top/Distribution/RLCL-FPF 5V (RLCL_U1_RLCL-FPF_5V.3)
NetEMIAA_C1_1: EPS_3V3_EMI-Filter_In (EMIAA_C1.1 EMIAA_L2.2 EMIAA_R1.1), EPS_5V_EMI-Filter_In (EMIBA_C1.1 EMIBA_L2.2 EMIBA_R1.1), Top/LCLs for DCDC/DCDC RLCL (RLCL_C4_DCDC_RLCL.1 RLCL_R6_DCDC_RLCL.2 RLCL_U1_DCDC_RLCL.8)
NetEMIAB_C1_1: EPS_3V3_EMI-Filter_Out (5 pins), Top/Distribution/3V3 Measurements (HK_R1_3V3_Measurements.1)
NetEMIBB_C1_1: EPS_5V_EMI-Filter_Out (5 pins), Top/Distribution/5V Measurements (HK_R1_5V_Measurements.1)
NetEMIVBAT_C1_1: Top/Distribution/VBAT Measurements (HK_R1_VBAT_Measurements.1), EPS_VBAT_EMI-Filter (5 pins)
NetEMIVBAT_FB1_2: EPS_VBAT_EMI-Filter (EMIVBAT_FB1.2 EMIVBAT_FB2.2), Top/LCLs for DCDC/VBAT RLCL (RLCL_C4_VBAT_RLCL.1 RLCL_R6_VBAT_RLCL.2 RLCL_U1_VBAT_RLCL.8)
NetEMIXI_C1_1: Top/MPPT X/MPPTX Measurements (MEAS_R1_MPPTX_Measurements.4), EPS_MPPT_X_EMI-Filter_In (EMIXI_C1.1 EMIXI_L2.2 EMIXI_R1.1)
NetEMIXO_C1_1: Top/MPPT X/MPPTX Interface to uC (MPPT_R13_MPPTX_Interface_to_uC.2), EPS_MPPT_X_EMI-Filter_Out (EMIXO_C1.1 EMIXO_C2.1 EMIXO_FB1.1 EMIXO_R1.2), EPS_MPPT_X_OR_MPB (5 pins)
NetEMIXS_C1_1: EPS_MPPT_X_OR_Solar (SUMX_D1.A SUMX_R3.1), EPS_MPPT_X_EMI-Filter_Solar-Panels (EMIXS_C1.1 EMIXS_FB1.1)
NetEMIXS_C2_1: EPS_MPPT_X_OR_Solar (SUMX_C2.1 SUMX_C3.1 SUMX_D1.K SUMX_U1.1), EPS_MPPT_X_EMI-Filter_Solar-Panels (EMIXS_C2.1 EMIXS_C3.1 EMIXS_FB2.1 EMIXS_FB3.1)
NetEMIXS_T1_1: EPS_Connectors (H6.3 H6.7), EPS_MPPT_X_EMI-Filter_Solar-Panels (EMIXS_T1.1)
NetEMIXS_T1_2: EPS_Connectors (H6.4 H6.8), EPS_MPPT_X_EMI-Filter_Solar-Panels (EMIXS_T1.2)
NetEMIXS_T2_1: EPS_Connectors (H7.3 H7.7), EPS_MPPT_X_EMI-Filter_Solar-Panels (EMIXS_T2.1)
NetEMIXS_T2_2: EPS_Connectors (H7.4 H7.8), EPS_MPPT_X_EMI-Filter_Solar-Panels (EMIXS_T2.2)
NetEMIYI_C1_Top_MPPT_Y+_MPPTY_Input_EMI_Filter_1: Top/MPPT Y+/MPPTY Measurements (MEAS_R1_Top_MPPT_Y+_MPPTY_Measurements.4), Top/MPPT Y+/MPPTY Input EMI Filter (EMIYI_C1_Top_MPPT_Y+_MPPTY_Input_EMI_Filter.1 EMIYI_L2_Top_MPPT_Y+_MPPTY_Input_EMI_Filter.2 EMIYI_R1_Top_MPPT_Y+_MPPTY_Input_EMI_Filter.1)
NetEMIYI_C1_Top_MPPT_Y-_MPPTY_Input_EMI_Filter_1: Top/MPPT Y-/MPPTY Measurements (MEAS_R1_Top_MPPT_Y-_MPPTY_Measurements.4), Top/MPPT Y-/MPPTY Input EMI Filter (EMIYI_C1_Top_MPPT_Y-_MPPTY_Input_EMI_Filter.1 EMIYI_L2_Top_MPPT_Y-_MPPTY_Input_EMI_Filter.2 EMIYI_R1_Top_MPPT_Y-_MPPTY_Input_EMI_Filter.1)
NetEMIYO_C1_Top_MPPT_Y+_MPPTY_Output_EMI_Filter_1: Top/MPPT Y+/MPPTY Interface to uC (MPPT_R13_Top_MPPT_Y+_MPPTY_Interface_to_uC.2), Top/MPPT Y+/MPPTY Output EMI Filter (EMIYO_C1_Top_MPPT_Y+_MPPTY_Output_EMI_Filter.1 EMIYO_C2_Top_MPPT_Y+_MPPTY_Output_EMI_Filter.1 EMIYO_FB1_Top_MPPT_Y+_MPPTY_Output_EMI_Filter.1 EMIYO_R1_Top_MPPT_Y+_MPPTY_Output_EMI_Filter.2), Top/MPPT Y+/MPPTY ORing to MPB (SUMPB_U1_Top_MPPT_Y+_MPPTY_ORing_to_MPB.1 SUMPBY_C1_Top_MPPT_Y+_MPPTY_ORing_to_MPB.1 SUMPBY_C2_Top_MPPT_Y+_MPPTY_ORing_to_MPB.1 SUMPBY_Q1_Top_MPPT_Y+_MPPTY_ORing_to_MPB.D)
NetEMIYO_C1_Top_MPPT_Y-_MPPTY_Output_EMI_Filter_1: Top/MPPT Y-/MPPTY Interface to uC (MPPT_R13_Top_MPPT_Y-_MPPTY_Interface_to_uC.2), Top/MPPT Y-/MPPTY Output EMI Filter (EMIYO_C1_Top_MPPT_Y-_MPPTY_Output_EMI_Filter.1 EMIYO_C2_Top_MPPT_Y-_MPPTY_Output_EMI_Filter.1 EMIYO_FB1_Top_MPPT_Y-_MPPTY_Output_EMI_Filter.1 EMIYO_R1_Top_MPPT_Y-_MPPTY_Output_EMI_Filter.2), Top/MPPT Y-/MPPTY ORing to MPB (SUMPB_U1_Top_MPPT_Y-_MPPTY_ORing_to_MPB.1 SUMPBY_C1_Top_MPPT_Y-_MPPTY_ORing_to_MPB.1 SUMPBY_C2_Top_MPPT_Y-_MPPTY_ORing_to_MPB.1 SUMPBY_Q1_Top_MPPT_Y-_MPPTY_ORing_to_MPB.D)
NetEMIYS_C1_Top_MPPT_Y+_MPPTY_EMI_Filters_for_Solar_Panels_1: Top/MPPT Y+/MPPTY Solar Panels ORing (SUMY_D1_Top_MPPT_Y+_MPPTY_Solar_Panels_ORing.A SUMY_R3_Top_MPPT_Y+_MPPTY_Solar_Panels_ORing.1), Top/MPPT Y+/MPPTY EMI Filters for Solar Panels (EMIYS_C1_Top_MPPT_Y+_MPPTY_EMI_Filters_for_Solar_Panels.1 EMIYS_FB1_Top_MPPT_Y+_MPPTY_EMI_Filters_for_Solar_Panels.1)
NetEMIYS_C1_Top_MPPT_Y-_MPPTY_EMI_Filters_for_Solar_Panels_1: Top/MPPT Y-/MPPTY Solar Panels ORing (SUMY_D1_Top_MPPT_Y-_MPPTY_Solar_Panels_ORing.A SUMY_R3_Top_MPPT_Y-_MPPTY_Solar_Panels_ORing.1), Top/MPPT Y-/MPPTY EMI Filters for Solar Panels (EMIYS_C1_Top_MPPT_Y-_MPPTY_EMI_Filters_for_Solar_Panels.1 EMIYS_FB1_Top_MPPT_Y-_MPPTY_EMI_Filters_for_Solar_Panels.1)
NetEMIYS_C2_Top_MPPT_Y+_MPPTY_EMI_Filters_for_Solar_Panels_1: Top/MPPT Y+/MPPTY Solar Panels ORing (SUMY_C2_Top_MPPT_Y+_MPPTY_Solar_Panels_ORing.1 SUMY_C3_Top_MPPT_Y+_MPPTY_Solar_Panels_ORing.1 SUMY_D1_Top_MPPT_Y+_MPPTY_Solar_Panels_ORing.K SUMY_U1_Top_MPPT_Y+_MPPTY_Solar_Panels_ORing.1), Top/MPPT Y+/MPPTY EMI Filters for Solar Panels (EMIYS_C2_Top_MPPT_Y+_MPPTY_EMI_Filters_for_Solar_Panels.1 EMIYS_FB2_Top_MPPT_Y+_MPPTY_EMI_Filters_for_Solar_Panels.1)
NetEMIYS_C2_Top_MPPT_Y-_MPPTY_EMI_Filters_for_Solar_Panels_1: Top/MPPT Y-/MPPTY Solar Panels ORing (SUMY_C2_Top_MPPT_Y-_MPPTY_Solar_Panels_ORing.1 SUMY_C3_Top_MPPT_Y-_MPPTY_Solar_Panels_ORing.1 SUMY_D1_Top_MPPT_Y-_MPPTY_Solar_Panels_ORing.K SUMY_U1_Top_MPPT_Y-_MPPTY_Solar_Panels_ORing.1), Top/MPPT Y-/MPPTY EMI Filters for Solar Panels (EMIYS_C2_Top_MPPT_Y-_MPPTY_EMI_Filters_for_Solar_Panels.1 EMIYS_FB2_Top_MPPT_Y-_MPPTY_EMI_Filters_for_Solar_Panels.1)
NetEMIYS_T1_Top_MPPT_Y+_MPPTY_EMI_Filters_for_Solar_Panels_1: EPS_Connectors (H7.1 H7.5), Top/MPPT Y+/MPPTY EMI Filters for Solar Panels (EMIYS_T1_Top_MPPT_Y+_MPPTY_EMI_Filters_for_Solar_Panels.1)
NetEMIYS_T1_Top_MPPT_Y+_MPPTY_EMI_Filters_for_Solar_Panels_2: EPS_Connectors (H7.2 H7.6), Top/MPPT Y+/MPPTY EMI Filters for Solar Panels (EMIYS_T1_Top_MPPT_Y+_MPPTY_EMI_Filters_for_Solar_Panels.2)
NetEMIYS_T1_Top_MPPT_Y-_MPPTY_EMI_Filters_for_Solar_Panels_1: EPS_Connectors (H6.1 H6.5), Top/MPPT Y-/MPPTY EMI Filters for Solar Panels (EMIYS_T1_Top_MPPT_Y-_MPPTY_EMI_Filters_for_Solar_Panels.1)
NetEMIYS_T1_Top_MPPT_Y-_MPPTY_EMI_Filters_for_Solar_Panels_2: EPS_Connectors (H6.2 H6.6), Top/MPPT Y-/MPPTY EMI Filters for Solar Panels (EMIYS_T1_Top_MPPT_Y-_MPPTY_EMI_Filters_for_Solar_Panels.2)
NetH3_1: EPS_Connectors (H3.1 H4.1), EPS_RBL (8 pins)
NetH5_2: EPS_Connectors (H5.2), EPS_RBL (6 pins)
NetH8_1: EPS_Connectors (H8.1 H8.6), Top/Distribution/LCL-FPF ANTs 5V (LCL_C2_Top_Distribution_LCL-FPF_ANTs_5V#1.1 LCL_R1_Top_Distribution_LCL-FPF_ANTs_5V#1.2 LCL_U1_Top_Distribution_LCL-FPF_ANTs_5V#1.8), Top/Distribution/LCL-FPF ANTs 5V (LCL_C2_Top_Distribution_LCL-FPF_ANTs_5V#2.1 LCL_R1_Top_Distribution_LCL-FPF_ANTs_5V#2.2 LCL_U1_Top_Distribution_LCL-FPF_ANTs_5V#2.8)
NetH9_16: EPS_Connectors (H9.16), EPS_Battery_Heaters-Control (HTR_R2.1)
NetHK_R1_3V3_Measurements_4: Top/Distribution/LCL-FPF SunS 3V3 (LCL_C1_LCL-FPF_SunS_3V3.1 LCL_C4_LCL-FPF_SunS_3V3.1 LCL_C5_LCL-FPF_SunS_3V3.1 LCL_U1_LCL-FPF_SunS_3V3.1), Top/Distribution/LCL-FPF CAMnadir 3V3 (LCL_C1_LCL-FPF_CAMnadir_3V3.1 LCL_C4_LCL-FPF_CAMnadir_3V3.1 LCL_C5_LCL-FPF_CAMnadir_3V3.1 LCL_U1_LCL-FPF_CAMnadir_3V3.1), Top/Distribution/LCL-FPF CAMwing 3V3 (LCL_C1_LCL-FPF_CAMwing_3V3.1 LCL_C4_LCL-FPF_CAMwing_3V3.1 LCL_C5_LCL-FPF_CAMwing_3V3.1 LCL_U1_LCL-FPF_CAMwing_3V3.1), Top/Distribution/3V3 Measurements (HK_R1_3V3_Measurements.4 HK_R3_3V3_Measurements.1), Top/Distribution/RLCL-FPF 3V3 (RLCL_C1_RLCL-FPF_3V3.1 RLCL_U1_RLCL-FPF_3V3.1)
NetHK_R1_5V_Measurements_4: Top/Distribution/LCL-FPF SENS 5V (LCL_C1_LCL-FPF_SENS_5V.1 LCL_C4_LCL-FPF_SENS_5V.1 LCL_C5_LCL-FPF_SENS_5V.1 LCL_U1_LCL-FPF_SENS_5V.1), Top/Distribution/RLCL-FPF 5V (RLCL_C1_RLCL-FPF_5V.1 RLCL_U1_RLCL-FPF_5V.1), Top/Distribution/5V Measurements (HK_R1_5V_Measurements.4 HK_R3_5V_Measurements.1), Top/Distribution/LCL-FPF ANTs 5V (LCL_C1_Top_Distribution_LCL-FPF_ANTs_5V#1.1 LCL_C4_Top_Distribution_LCL-FPF_ANTs_5V#1.1 LCL_C5_Top_Distribution_LCL-FPF_ANTs_5V#1.1 LCL_U1_Top_Distribution_LCL-FPF_ANTs_5V#1.1), Top/Distribution/LCL-FPF ANTs 5V (LCL_C1_Top_Distribution_LCL-FPF_ANTs_5V#2.1 LCL_C4_Top_Distribution_LCL-FPF_ANTs_5V#2.1 LCL_C5_Top_Distribution_LCL-FPF_ANTs_5V#2.1 LCL_U1_Top_Distribution_LCL-FPF_ANTs_5V#2.1)
NetLCLTK_C1_LCL-TK_MAIN_1: EPS_RBL (RBL_Q1.D RBL_Q3.D), Top/Distribution/LCL-TK MAIN (5 pins), Top/Distribution/LCL-TK Redundant (5 pins), Top/LCLs for DCDC/DCDC RLCL (RLCL_C1_DCDC_RLCL.1 RLCL_C2_DCDC_RLCL.1 RLCL_C3_DCDC_RLCL.1 RLCL_U1_DCDC_RLCL.1), Top/LCLs for DCDC/VBAT RLCL (RLCL_C1_VBAT_RLCL.1 RLCL_C2_VBAT_RLCL.1 RLCL_C3_VBAT_RLCL.1 RLCL_U1_VBAT_RLCL.1), EPS_Local-Supply (LS_FB1.1 LS_FB2.1)
NetLS_C1_1: EPS_Local-Supply (LS_C1.1 LS_FB1.2 LS_FB2.2 LS_R2.1), Top/Local-Supply and WDTs/Local-Supply CTRL-A (SUPP_C4_Local-Supply_CTRL-A.1 SUPP_U1_Local-Supply_CTRL-A.1 SUPP_U1_Local-Supply_CTRL-A.3), Top/Local-Supply and WDTs/Local-Supply CTRL-B (SUPP_C4_Local-Supply_CTRL-B.1 SUPP_U1_Local-Supply_CTRL-B.1 SUPP_U1_Local-Supply_CTRL-B.3)
NetMEAS_R1_MPPTX_Measurements_1: EPS_MPPT_X_OR_Solar (SUMX_C1.1 SUMX_R1.1 SUMX_R2.1 SUMX_U1.8), Top/MPPT X/MPPTX Measurements (MEAS_R1_MPPTX_Measurements.1 MEAS_R2_MPPTX_Measurements.1)
NetMEAS_R1_Top_MPPT_Y+_MPPTY_Measurements_1: Top/MPPT Y+/MPPTY Solar Panels ORing (SUMY_C1_Top_MPPT_Y+_MPPTY_Solar_Panels_ORing.1 SUMY_R1_Top_MPPT_Y+_MPPTY_Solar_Panels_ORing.1 SUMY_R2_Top_MPPT_Y+_MPPTY_Solar_Panels_ORing.1 SUMY_U1_Top_MPPT_Y+_MPPTY_Solar_Panels_ORing.8), Top/MPPT Y+/MPPTY Measurements (MEAS_R1_Top_MPPT_Y+_MPPTY_Measurements.1 MEAS_R2_Top_MPPT_Y+_MPPTY_Measurements.1)
NetMEAS_R1_Top_MPPT_Y-_MPPTY_Measurements_1: Top/MPPT Y-/MPPTY Solar Panels ORing (SUMY_C1_Top_MPPT_Y-_MPPTY_Solar_Panels_ORing.1 SUMY_R1_Top_MPPT_Y-_MPPTY_Solar_Panels_ORing.1 SUMY_R2_Top_MPPT_Y-_MPPTY_Solar_Panels_ORing.1 SUMY_U1_Top_MPPT_Y-_MPPTY_Solar_Panels_ORing.8), Top/MPPT Y-/MPPTY Measurements (MEAS_R1_Top_MPPT_Y-_MPPTY_Measurements.1 MEAS_R2_Top_MPPT_Y-_MPPTY_Measurements.1)
NetRLCL_U1_DCDC_RLCL_4: EPS_DCDC_RLCLs (6 pins), Top/LCLs for DCDC/DCDC RLCL (RLCL_U1_DCDC_RLCL.4), Top/LCLs for DCDC/VBAT RLCL (RLCL_U1_VBAT_RLCL.4)
NetTEMP_C1_Top_3V3_Temperature-Sensor_1: EPS_3V3 (TEMP_R4.1), Top/3V3/Temperature-Sensor (TEMP_C1_Top_3V3_Temperature-Sensor.1 TEMP_U1_Top_3V3_Temperature-Sensor.1 TEMP_U1_Top_3V3_Temperature-Sensor.4 TEMP_U1_Top_3V3_Temperature-Sensor.5)
NetTEMP_C1_Top_5V_Temperature-Sensor_1: EPS_5V (TEMP_R1.1), Top/5V/Temperature-Sensor (TEMP_C1_Top_5V_Temperature-Sensor.1 TEMP_U1_Top_5V_Temperature-Sensor.1 TEMP_U1_Top_5V_Temperature-Sensor.4 TEMP_U1_Top_5V_Temperature-Sensor.5)
NetTEMP_C1_Top_Battery_Pack_Temperature-Sensor_1: EPS_Battery (TEMP_R2.1), Top/Battery Pack/Temperature-Sensor (TEMP_C1_Top_Battery_Pack_Temperature-Sensor.1 TEMP_U1_Top_Battery_Pack_Temperature-Sensor.1 TEMP_U1_Top_Battery_Pack_Temperature-Sensor.4 TEMP_U1_Top_Battery_Pack_Temperature-Sensor.5)
NetTEMP_C1_Top_Local-Supply_and_WDTs_Local-Supply_CTRL-A_Temperature-Sensor_1: Top/Local-Supply and WDTs/Local-Supply CTRL-A (TEMP_R5_Local-Supply_CTRL-A.1), Top/Local-Supply and WDTs/Local-Supply CTRL-A/Temperature-Sensor (TEMP_C1_Top_Local-Supply_and_WDTs_Local-Supply_CTRL-A_Temperature-Sensor.1 TEMP_U1_Top_Local-Supply_and_WDTs_Local-Supply_CTRL-A_Temperature-Sensor.1 TEMP_U1_Top_Local-Supply_and_WDTs_Local-Supply_CTRL-A_Temperature-Sensor.4 TEMP_U1_Top_Local-Supply_and_WDTs_Local-Supply_CTRL-A_Temperature-Sensor.5)
NetTEMP_C1_Top_Local-Supply_and_WDTs_Local-Supply_CTRL-B_Temperature-Sensor_1: Top/Local-Supply and WDTs/Local-Supply CTRL-B (TEMP_R5_Local-Supply_CTRL-B.1), Top/Local-Supply and WDTs/Local-Supply CTRL-B/Temperature-Sensor (TEMP_C1_Top_Local-Supply_and_WDTs_Local-Supply_CTRL-B_Temperature-Sensor.1 TEMP_U1_Top_Local-Supply_and_WDTs_Local-Supply_CTRL-B_Temperature-Sensor.1 TEMP_U1_Top_Local-Supply_and_WDTs_Local-Supply_CTRL-B_Temperature-Sensor.4 TEMP_U1_Top_Local-Supply_and_WDTs_Local-Supply_CTRL-B_Temperature-Sensor.5)
PC-104_EXTX: EPS_MPPT_X_EMI-Filter_Solar-Panels (EMIXS_FB1.2), EPS_Connectors_PC-104 (H1.13)
PC-104_EXTY+: Top/MPPT Y+/MPPTY EMI Filters for Solar Panels (EMIYS_FB1_Top_MPPT_Y+_MPPTY_EMI_Filters_for_Solar_Panels.2), EPS_Connectors_PC-104 (H1.15)
PC-104_EXTY-: Top/MPPT Y-/MPPTY EMI Filters for Solar Panels (EMIYS_FB1_Top_MPPT_Y-_MPPTY_EMI_Filters_for_Solar_Panels.2), EPS_Connectors_PC-104 (H1.17)
PC-104_I2C-Bus_SCL: EPS_Connectors (H8.7), Top/Controller A/I2C Repeater (RPT_R4_Top_Controller_A_I2C_Repeater.2), EPS_Connectors_PC-104 (H1.43)
PC-104_I2C-Bus_SDA: EPS_Connectors (H8.2), Top/Controller A/I2C Repeater (RPT_R6_Top_Controller_A_I2C_Repeater.2), EPS_Connectors_PC-104 (H1.41)
PC-104_I2C-Payload_SCL: EPS_Connectors (H8.8), Top/Controller B/I2C Repeater (RPT_R4_Top_Controller_B_I2C_Repeater.2), EPS_Connectors_PC-104 (H1.21)
PC-104_I2C-Payload_SDA: EPS_Connectors (H8.4), Top/Controller B/I2C Repeater (RPT_R6_Top_Controller_B_I2C_Repeater.2), EPS_Connectors_PC-104 (H1.23)
PC-104_LCL_3V3: Top/Distribution/RLCL-FPF 3V3 (RLCL_C2_RLCL-FPF_3V3.1 RLCL_R1_RLCL-FPF_3V3.2 RLCL_R4_RLCL-FPF_3V3.2 RLCL_U1_RLCL-FPF_3V3.8), EPS_Connectors_PC-104 (5 pins)
PC-104_LCL_5V: Top/Distribution/RLCL-FPF 5V (RLCL_C2_RLCL-FPF_5V.1 RLCL_R1_RLCL-FPF_5V.2 RLCL_R4_RLCL-FPF_5V.2 RLCL_U1_RLCL-FPF_5V.8), EPS_Connectors_PC-104 (H2.25 H2.26)
PC-104_LCL_CAMnadir_3V3: Top/Distribution/LCL-FPF CAMnadir 3V3 (LCL_C2_LCL-FPF_CAMnadir_3V3.1 LCL_R1_LCL-FPF_CAMnadir_3V3.2 LCL_U1_LCL-FPF_CAMnadir_3V3.8), EPS_Connectors_PC-104 (H2.37)
PC-104_LCL_CAMwing_3V3: Top/Distribution/LCL-FPF CAMwing 3V3 (LCL_C2_LCL-FPF_CAMwing_3V3.1 LCL_R1_LCL-FPF_CAMwing_3V3.2 LCL_U1_LCL-FPF_CAMwing_3V3.8), EPS_Connectors_PC-104 (H2.35)
PC-104_LCL_SADSmain: Top/Distribution/LCL-TK MAIN (LCLTK_Q3_LCL-TK_MAIN.D), EPS_Connectors_PC-104 (H1.39)
PC-104_LCL_SADSred: Top/Distribution/LCL-TK Redundant (LCLTK_Q3_LCL-TK_Redundant.D), EPS_Connectors_PC-104 (H1.40)
PC-104_LCL_SAILmain: Top/Distribution/LCL-TK MAIN (LCLTK_Q1_LCL-TK_MAIN.D), EPS_Connectors_PC-104 (H1.37)
PC-104_LCL_SAILred: Top/Distribution/LCL-TK Redundant (LCLTK_Q1_LCL-TK_Redundant.D), EPS_Connectors_PC-104 (H1.38)
PC-104_LCL_SENS_5V: Top/Distribution/LCL-FPF SENS 5V (LCL_C2_LCL-FPF_SENS_5V.1 LCL_R1_LCL-FPF_SENS_5V.2 LCL_U1_LCL-FPF_SENS_5V.8), EPS_Connectors_PC-104 (H1.35)
PC-104_LCL_SunS_3V3: Top/Distribution/LCL-FPF SunS 3V3 (LCL_C2_LCL-FPF_SunS_3V3.1 LCL_R1_LCL-FPF_SunS_3V3.2 LCL_U1_LCL-FPF_SunS_3V3.8), EPS_Connectors_PC-104 (H2.39)
PC-104_LCL_VBAT: Top/Distribution/VBAT Measurements (HK_R1_VBAT_Measurements.4 HK_R3_VBAT_Measurements.1), EPS_Connectors_PC-104 (H2.45 H2.46)